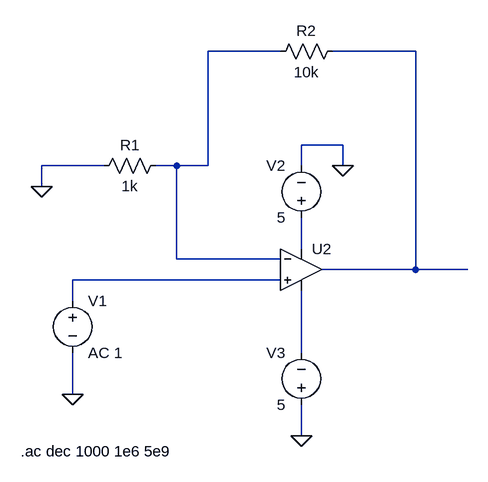
[diagram p0: schematic non_inverter.asc]
non_inverter.asc, the LTspice schematic file:
Version 4
SHEET 1 880 680
WIRE 272 -112 160 -112
WIRE 480 -112 352 -112
WIRE 368 32 304 32
WIRE 0 64 -96 64
WIRE 112 64 80 64
WIRE 160 64 160 -112
WIRE 160 64 112 64
WIRE 304 64 304 32
WIRE 368 64 368 32
WIRE -96 96 -96 64
WIRE 304 192 304 144
WIRE 112 208 112 64
WIRE 272 208 112 208
WIRE 480 224 480 -112
WIRE 480 224 336 224
WIRE 560 224 480 224
WIRE 272 240 -48 240
WIRE -48 272 -48 240
WIRE 304 352 304 256
WIRE -48 416 -48 352
WIRE 304 480 304 432
FLAG 304 480 0
FLAG 368 64 0
FLAG -48 416 0
FLAG -96 96 0
SYMBOL voltage -48 256 R0
WINDOW 123 0 0 Left 0
WINDOW 39 0 0 Left 0
SYMATTR InstName V1
SYMATTR Value AC 1
SYMBOL res 96 48 R90
WINDOW 0 0 56 VBottom 2
WINDOW 3 32 56 VTop 2
SYMATTR InstName R1
SYMATTR Value 1k
SYMBOL res 368 -128 R90
WINDOW 0 0 56 VBottom 2
WINDOW 3 32 56 VTop 2
SYMATTR InstName R2
SYMATTR Value 10k
SYMBOL voltage 304 160 R180
WINDOW 0 24 96 Left 2
WINDOW 3 24 16 Left 2
WINDOW 123 0 0 Left 0
WINDOW 39 0 0 Left 0
SYMATTR InstName V2
SYMATTR Value 5
SYMBOL voltage 304 448 R180
WINDOW 0 24 96 Left 2
WINDOW 3 24 16 Left 2
WINDOW 123 0 0 Left 0
WINDOW 39 0 0 Left 0
SYMATTR InstName V3
SYMATTR Value 5
SYMBOL OpAmps\\UniversalOpAmp1 304 224 R0
SYMATTR InstName U2
SYMATTR Value2 Avol=1Meg GBW=120Meg Vos=0
TEXT -128 504 Left 2 !.ac dec 1000 1e6 5e9

The netlist it stands for:
* non_inverter.asc
V1 N004 0 AC 1
R1 N001 0 1k
R2 N002 N001 10k
V2 N003 0 5
V3 0 N005 5
XU2 N004 N001 N003 N005 N002 level1 Avol=1Meg GBW=120Meg Vos=0 En=0 Enk=0 In=0 Ink=0 Rin=500Meg  ; pins In+ In- V+ V- OUT
.ac dec 1000 1e6 5e9
.lib UniversalOpAmp1.lib
.backanno
.end